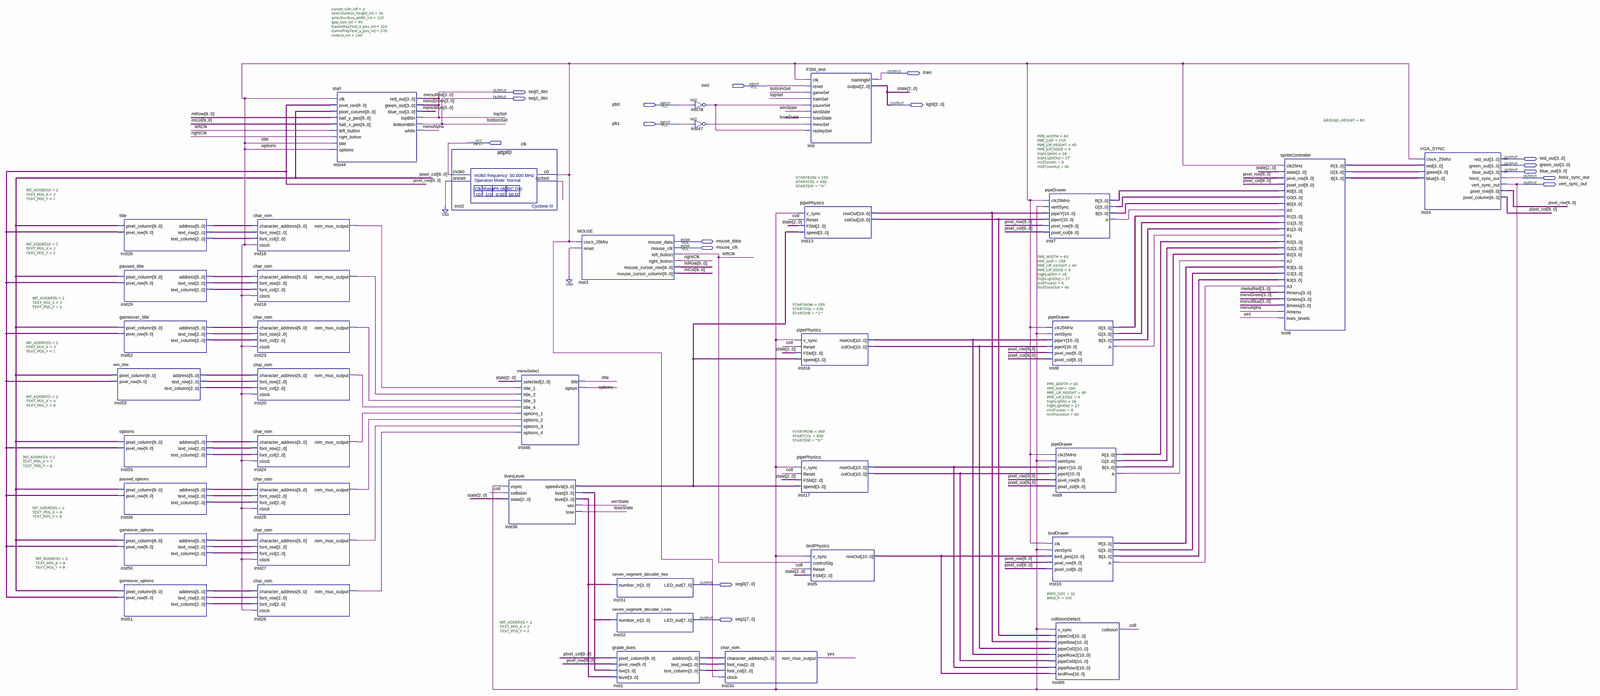
[diagram p0: schematic sheet, whole]
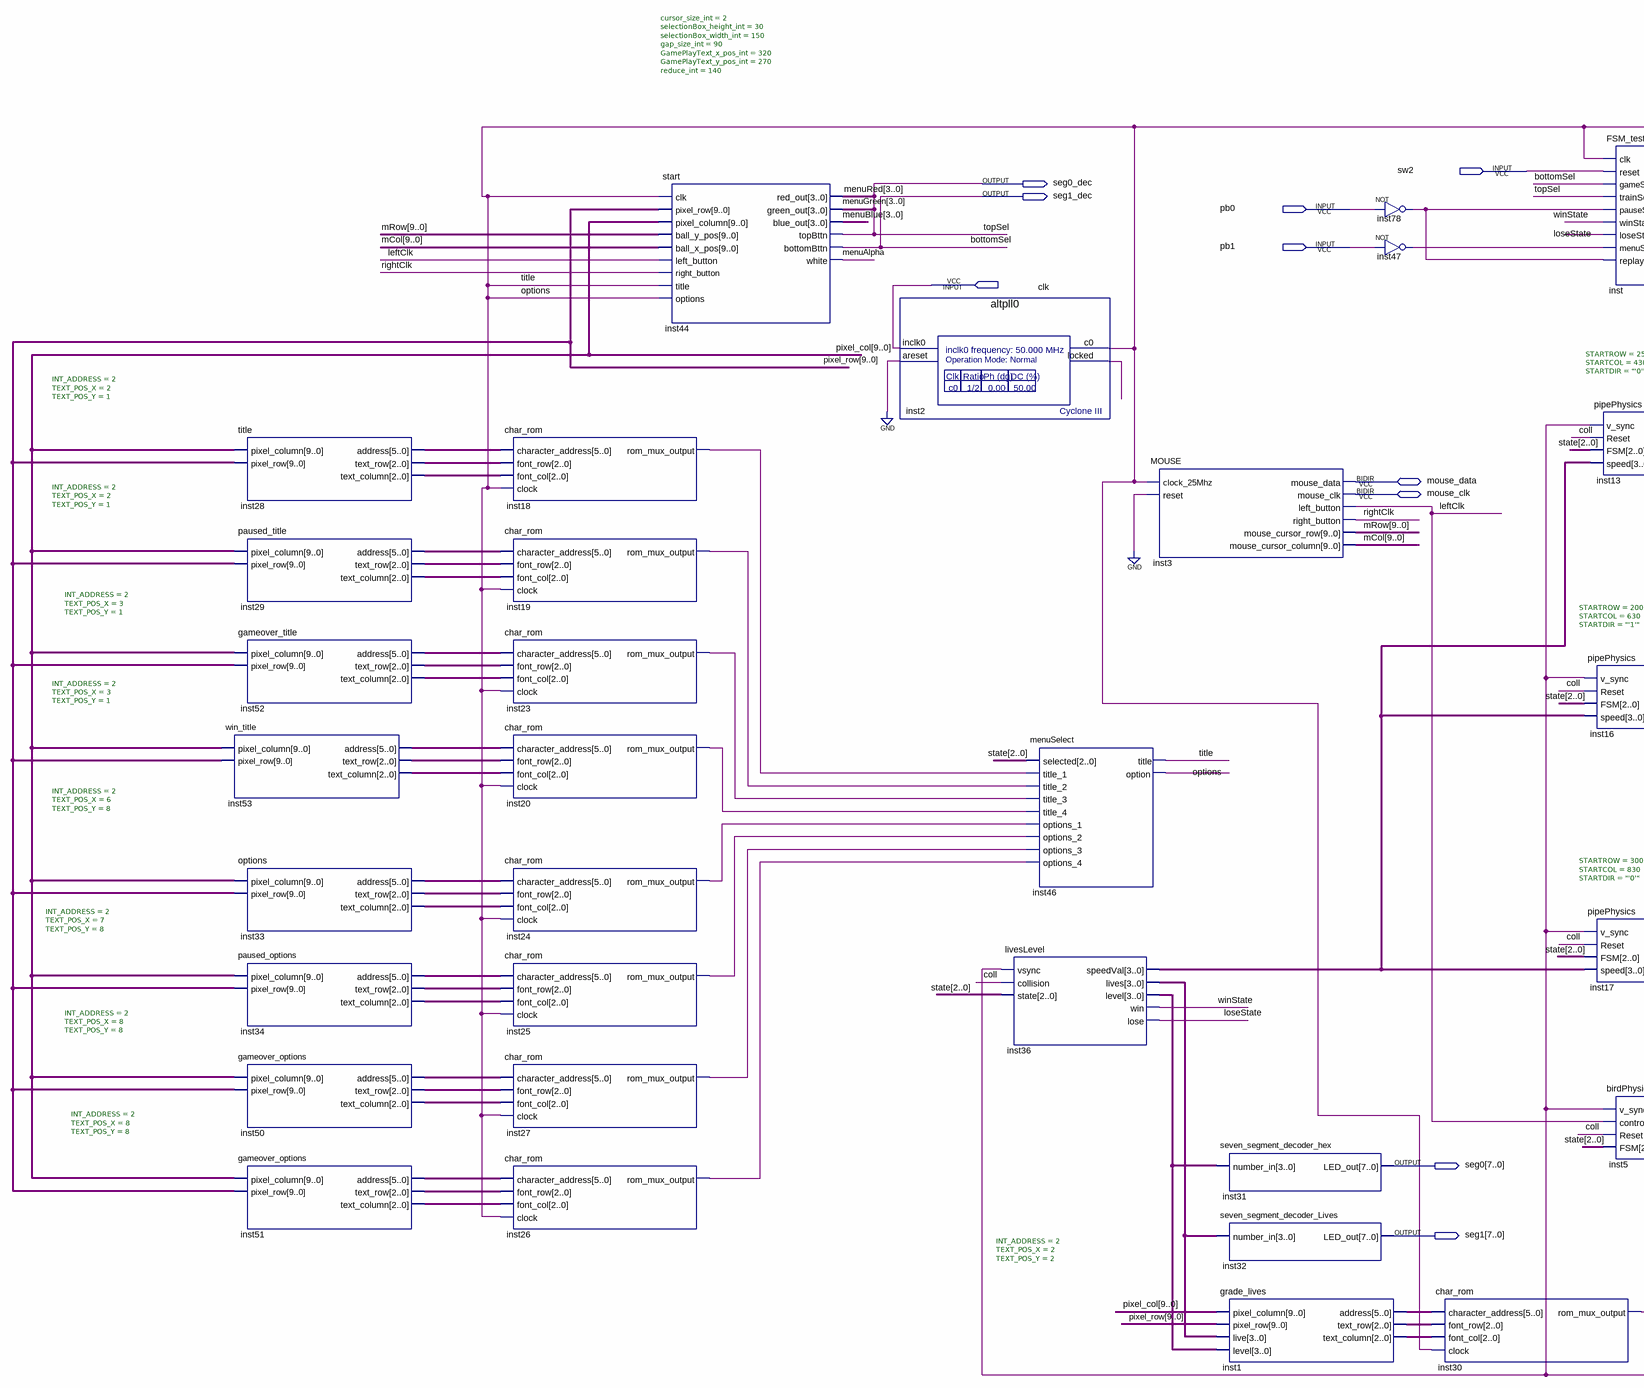
[diagram p1: schematic sheet, left part]
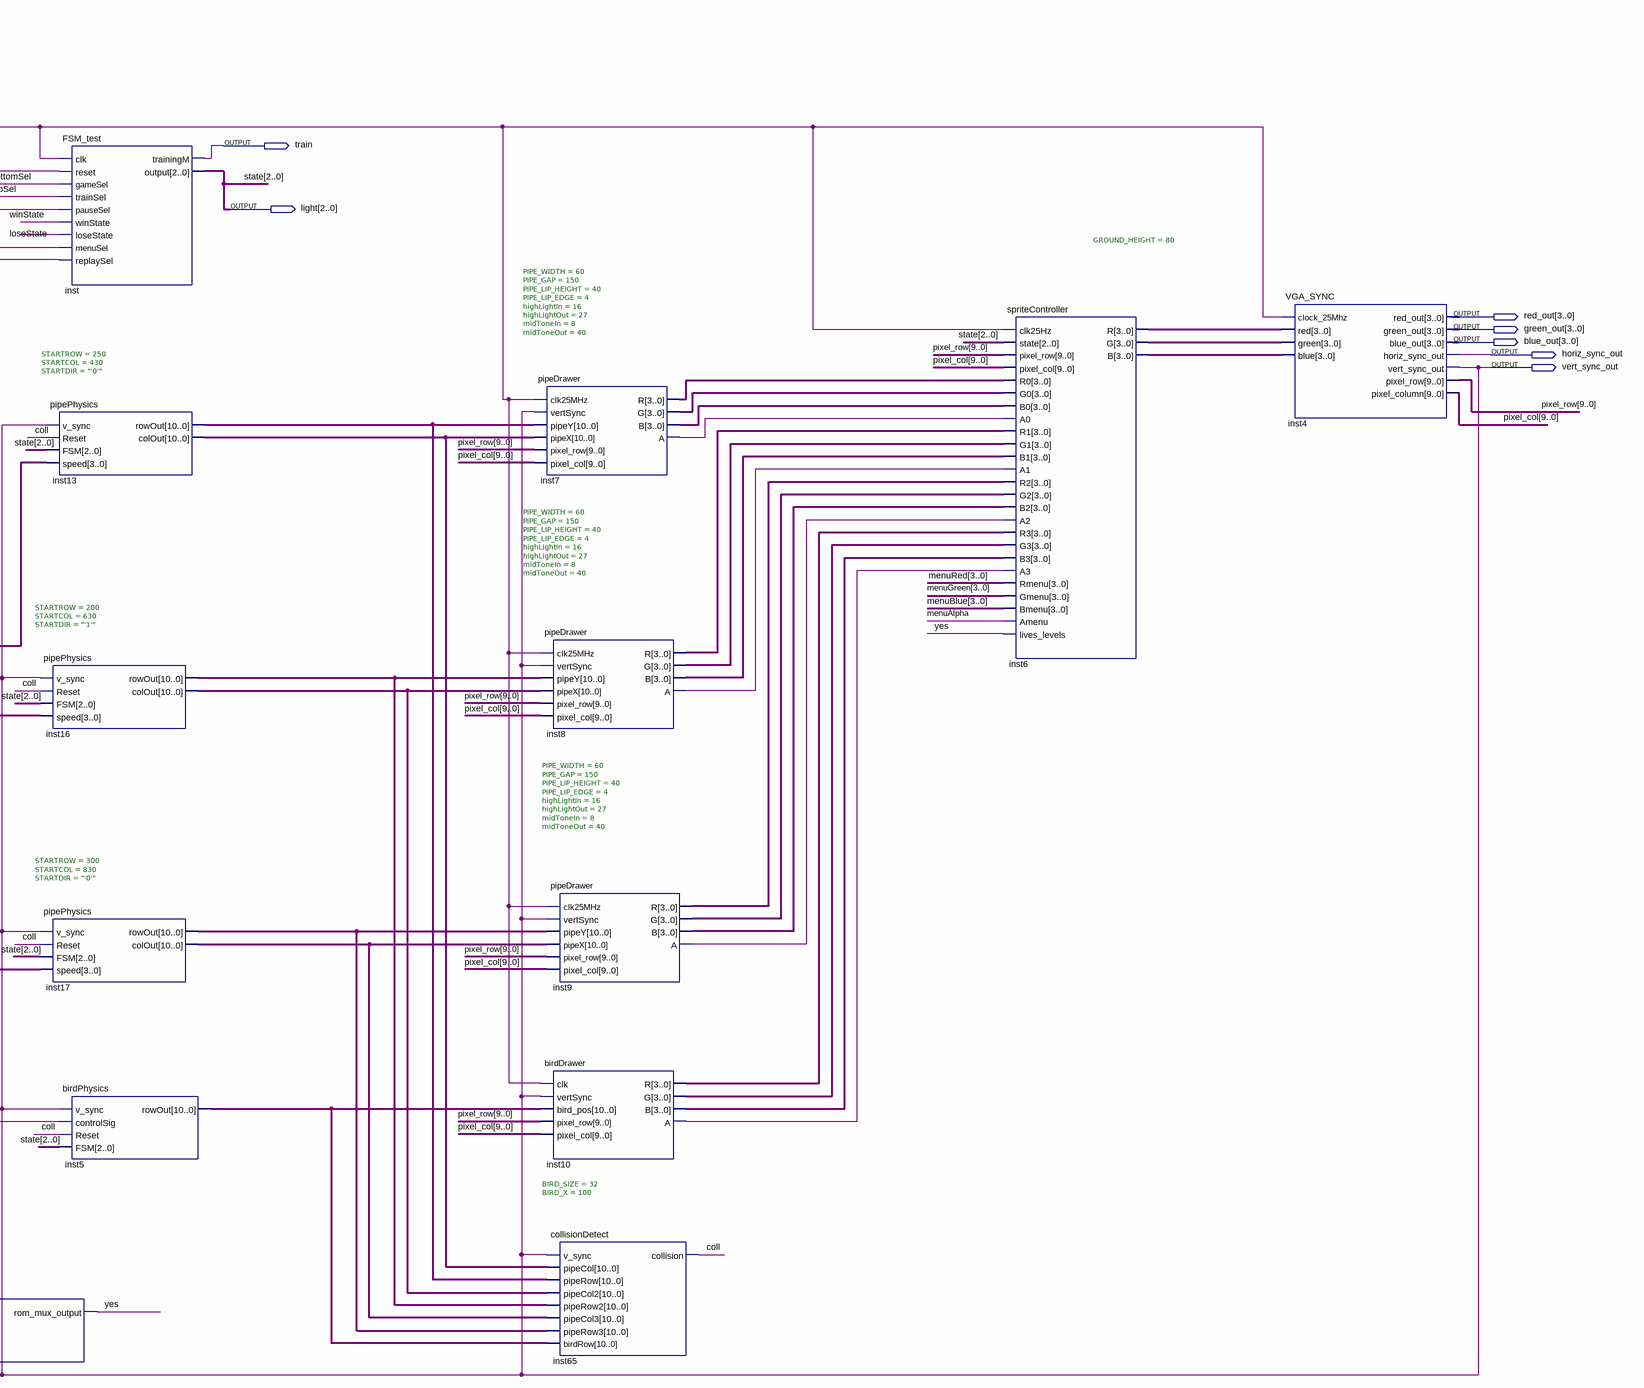
[diagram p2: schematic sheet, right part]
// Quartus schematic Flappy-Grades.bdf as structural Verilog: 39 symbols, 17 pins
module \Flappy-Grades  (
  input  sw2,
  input  pb0,
  input  pb1,
  input  clk,
  inout  mouse_data,
  inout  mouse_clk,
  output train,
  output seg0_dec,
  output seg1_dec,
  output [2:0] light,
  output [3:0] red_out,
  output [3:0] green_out,
  output [3:0] blue_out,
  output horiz_sync_out,
  output vert_sync_out,
  output [7:0] seg0,
  output [7:0] seg1
);

  wire coll, inst2_locked, inst7_a, inst8_a, inst9_a, inst10_a, inst18_rom_mux_output, inst19_rom_mux_output,
       inst20_rom_mux_output, inst23_rom_mux_output, inst24_rom_mux_output, inst25_rom_mux_output,
       inst26_rom_mux_output, inst27_rom_mux_output, inst47_out, inst78_out, leftClk, loseState, menuAlpha,
       options, rightClk, topSel, winState, yes;
  wire [2:0] inst1_text_column, inst1_text_row, inst28_text_column, inst28_text_row, inst29_text_column,
       inst29_text_row, inst33_text_column, inst33_text_row, inst34_text_column, inst34_text_row,
       inst50_text_column, inst50_text_row, inst51_text_column, inst51_text_row, inst52_text_column,
       inst52_text_row, inst53_text_column, inst53_text_row;
  wire [3:0] inst6_b, inst6_g, inst6_r, inst7_b, inst7_g, inst7_r, inst8_b, inst8_g, inst8_r, inst9_b,
       inst9_g, inst9_r, inst10_b, inst10_g, inst10_r, inst36_level, inst36_lives, inst36_speedval, menuBlue,
       menuGreen, menuRed;
  wire [5:0] inst1_address, inst28_address, inst29_address, inst33_address, inst34_address, inst50_address,
       inst51_address, inst52_address, inst53_address;
  wire [9:0] mCol, mRow, pixel_col, pixel_row;
  wire [10:0] inst5_rowout, inst13_colout, inst13_rowout, inst16_colout, inst16_rowout, inst17_colout,
       inst17_rowout;

  title #(.INT_ADDRESS(2), .TEXT_POS_X(2), .TEXT_POS_Y(1)) inst28 (
    .pixel_column(pixel_col), .pixel_row(pixel_row), .address(inst28_address), .text_row(inst28_text_row),
    .text_column(inst28_text_column));
  paused_title #(.INT_ADDRESS(2), .TEXT_POS_X(2), .TEXT_POS_Y(1)) inst29 (
    .pixel_column(pixel_col), .pixel_row(pixel_row), .address(inst29_address), .text_row(inst29_text_row),
    .text_column(inst29_text_column));
  gameover_title #(.INT_ADDRESS(2), .TEXT_POS_X(3), .TEXT_POS_Y(1)) inst52 (
    .pixel_column(pixel_col), .pixel_row(pixel_row), .address(inst52_address), .text_row(inst52_text_row),
    .text_column(inst52_text_column));
  win_title #(.INT_ADDRESS(2), .TEXT_POS_X(3), .TEXT_POS_Y(1)) inst53 (
    .pixel_column(pixel_col), .pixel_row(pixel_row), .address(inst53_address), .text_row(inst53_text_row),
    .text_column(inst53_text_column));
  options #(.INT_ADDRESS(2), .TEXT_POS_X(6), .TEXT_POS_Y(8)) inst33 (
    .pixel_column(pixel_col), .pixel_row(pixel_row), .address(inst33_address), .text_row(inst33_text_row),
    .text_column(inst33_text_column));
  paused_options #(.INT_ADDRESS(2), .TEXT_POS_X(7), .TEXT_POS_Y(8)) inst34 (
    .pixel_column(pixel_col), .pixel_row(pixel_row), .address(inst34_address), .text_row(inst34_text_row),
    .text_column(inst34_text_column));
  gameover_options #(.INT_ADDRESS(2), .TEXT_POS_X(8), .TEXT_POS_Y(8)) inst50 (
    .pixel_column(pixel_col), .pixel_row(pixel_row), .address(inst50_address), .text_row(inst50_text_row),
    .text_column(inst50_text_column));
  gameover_options #(.INT_ADDRESS(2), .TEXT_POS_X(8), .TEXT_POS_Y(8)) inst51 (
    .pixel_column(pixel_col), .pixel_row(pixel_row), .address(inst51_address), .text_row(inst51_text_row),
    .text_column(inst51_text_column));
  char_rom inst18 (
    .character_address(inst28_address), .font_row(inst28_text_row), .font_col(inst28_text_column),
    .clock(options), .rom_mux_output(inst18_rom_mux_output));
  char_rom inst19 (
    .character_address(inst29_address), .font_row(inst29_text_row), .font_col(inst29_text_column),
    .clock(options), .rom_mux_output(inst19_rom_mux_output));
  char_rom inst23 (
    .character_address(inst52_address), .font_row(inst52_text_row), .font_col(inst52_text_column),
    .clock(options), .rom_mux_output(inst23_rom_mux_output));
  char_rom inst20 (
    .character_address(inst53_address), .font_row(inst53_text_row), .font_col(inst53_text_column),
    .clock(options), .rom_mux_output(inst20_rom_mux_output));
  char_rom inst24 (
    .character_address(inst33_address), .font_row(inst33_text_row), .font_col(inst33_text_column),
    .clock(options), .rom_mux_output(inst24_rom_mux_output));
  char_rom inst25 (
    .character_address(inst34_address), .font_row(inst34_text_row), .font_col(inst34_text_column),
    .clock(options), .rom_mux_output(inst25_rom_mux_output));
  char_rom inst27 (
    .character_address(inst50_address), .font_row(inst50_text_row), .font_col(inst50_text_column),
    .clock(options), .rom_mux_output(inst27_rom_mux_output));
  char_rom inst26 (
    .character_address(inst51_address), .font_row(inst51_text_row), .font_col(inst51_text_column),
    .clock(options), .rom_mux_output(inst26_rom_mux_output));
  start #(.cursor_size_int(2), .selectionBox_height_int(30), .selectionBox_width_int(150), .gap_size_int(90), .GamePlayText_x_pos_int(320), .GamePlayText_y_pos_int(270), .reduce_int(140)) inst44 (
    .clk(options), .pixel_row(pixel_row), .pixel_column(pixel_col), .ball_y_pos(mRow), .ball_x_pos(mCol),
    .left_button(leftClk), .right_button(rightClk), .title(options), .options(options), .red_out(menuRed),
    .green_out(menuGreen), .blue_out(menuBlue), .topBttn(topSel), .bottomBttn(seg1_dec), .white(menuAlpha));
  altpll0 inst2 (.inclk0(clk), .areset(1'b0), .c0(options), .locked(inst2_locked));
  menuSelect inst46 (
    .selected(light), .title_1(inst18_rom_mux_output), .title_2(inst19_rom_mux_output),
    .title_3(inst23_rom_mux_output), .title_4(inst20_rom_mux_output), .options_1(inst24_rom_mux_output),
    .options_2(inst25_rom_mux_output), .options_3(inst27_rom_mux_output), .options_4(inst26_rom_mux_output),
    .title(options), .option(options));
  livesLevel inst36 (
    .vsync(vert_sync_out), .collision(coll), .state(light), .speedVal(inst36_speedval), .lives(inst36_lives),
    .level(inst36_level), .win(winState), .lose(loseState));
  MOUSE inst3 (
    .clock_25Mhz(options), .reset(1'b0), .left_button(leftClk), .right_button(rightClk),
    .mouse_cursor_row(mRow), .mouse_cursor_column(mCol), .mouse_data(mouse_data), .mouse_clk(mouse_clk));
  seven_segment_decoder_hex inst31 (.number_in(inst36_level), .LED_out(seg0));
  seven_segment_decoder_Lives inst32 (.number_in(inst36_lives), .LED_out(seg1));
  grade_lives #(.INT_ADDRESS(2), .TEXT_POS_X(2), .TEXT_POS_Y(2)) inst1 (
    .pixel_column(pixel_col), .pixel_row(pixel_row), .live(inst36_lives), .level(inst36_level),
    .address(inst1_address), .text_row(inst1_text_row), .text_column(inst1_text_column));
  not inst78 (inst78_out, pb0);
  not inst47 (inst47_out, pb1);
  char_rom inst30 (
    .character_address(inst1_address), .font_row(inst1_text_row), .font_col(inst1_text_column),
    .clock(options), .rom_mux_output(yes));
  pipePhysics #(.STARTROW(200), .STARTCOL(630), .STARTDIR("'1'")) inst16 (
    .v_sync(vert_sync_out), .Reset(coll), .FSM(light), .speed(inst36_speedval), .rowOut(inst16_rowout),
    .colOut(inst16_colout));
  pipePhysics #(.STARTROW(300), .STARTCOL(830), .STARTDIR("'0'")) inst17 (
    .v_sync(vert_sync_out), .Reset(coll), .FSM(light), .speed(inst36_speedval), .rowOut(inst17_rowout),
    .colOut(inst17_colout));
  FSM_test inst (
    .clk(options), .reset(sw2), .gameSel(seg1_dec), .trainSel(topSel), .pauseSel(inst78_out),
    .winState(winState), .loseState(loseState), .menuSel(inst47_out), .replaySel(inst78_out),
    .trainingM(train), .\output (light));
  pipePhysics #(.STARTROW(250), .STARTCOL(430), .STARTDIR("'0'")) inst13 (
    .v_sync(vert_sync_out), .Reset(coll), .FSM(light), .speed(inst36_speedval), .rowOut(inst13_rowout),
    .colOut(inst13_colout));
  birdPhysics inst5 (.v_sync(vert_sync_out), .controlSig(leftClk), .Reset(coll), .FSM(light), .rowOut(inst5_rowout));
  pipeDrawer #(.PIPE_WIDTH(60), .PIPE_GAP(150), .PIPE_LIP_HEIGHT(40), .PIPE_LIP_EDGE(4), .highLightIn(16), .highLightOut(27), .midToneIn(8), .midToneOut(40)) inst7 (
    .clk25MHz(options), .vertSync(vert_sync_out), .pipeY(inst13_rowout), .pipeX(inst13_colout),
    .pixel_row(pixel_row), .pixel_col(pixel_col), .R(inst7_r), .G(inst7_g), .B(inst7_b), .A(inst7_a));
  pipeDrawer #(.PIPE_WIDTH(60), .PIPE_GAP(150), .PIPE_LIP_HEIGHT(40), .PIPE_LIP_EDGE(4), .highLightIn(16), .highLightOut(27), .midToneIn(8), .midToneOut(40)) inst8 (
    .clk25MHz(options), .vertSync(vert_sync_out), .pipeY(inst16_rowout), .pipeX(inst16_colout),
    .pixel_row(pixel_row), .pixel_col(pixel_col), .R(inst8_r), .G(inst8_g), .B(inst8_b), .A(inst8_a));
  pipeDrawer #(.PIPE_WIDTH(60), .PIPE_GAP(150), .PIPE_LIP_HEIGHT(40), .PIPE_LIP_EDGE(4), .highLightIn(16), .highLightOut(27), .midToneIn(8), .midToneOut(40)) inst9 (
    .clk25MHz(options), .vertSync(vert_sync_out), .pipeY(inst17_rowout), .pipeX(inst17_colout),
    .pixel_row(pixel_row), .pixel_col(pixel_col), .R(inst9_r), .G(inst9_g), .B(inst9_b), .A(inst9_a));
  birdDrawer #(.BIRD_SIZE(32), .BIRD_X(100)) inst10 (
    .clk(options), .vertSync(vert_sync_out), .bird_pos(inst5_rowout), .pixel_row(pixel_row),
    .pixel_col(pixel_col), .R(inst10_r), .G(inst10_g), .B(inst10_b), .A(inst10_a));
  collisionDetect inst65 (
    .v_sync(vert_sync_out), .pipeCol(inst13_colout), .pipeRow(inst13_rowout), .pipeCol2(inst16_colout),
    .pipeRow2(inst16_rowout), .pipeCol3(inst17_colout), .pipeRow3(inst17_rowout), .birdRow(inst5_rowout),
    .collision(coll));
  spriteController #(.GROUND_HEIGHT(80)) inst6 (
    .clk25Hz(options), .state(light), .pixel_row(pixel_row), .pixel_col(pixel_col), .R0(inst7_r),
    .G0(inst7_g), .B0(inst7_b), .A0(inst7_a), .R1(inst8_r), .G1(inst8_g), .B1(inst8_b), .A1(inst8_a),
    .R2(inst9_r), .G2(inst9_g), .B2(inst9_b), .A2(inst9_a), .R3(inst10_r), .G3(inst10_g), .B3(inst10_b),
    .A3(inst10_a), .Rmenu(menuRed), .Gmenu(menuGreen), .Bmenu(menuBlue), .Amenu(menuAlpha),
    .lives_levels(yes), .R(inst6_r), .G(inst6_g), .B(inst6_b));
  VGA_SYNC inst4 (
    .clock_25Mhz(options), .red(inst6_r), .green(inst6_g), .blue(inst6_b), .red_out(red_out),
    .green_out(green_out), .blue_out(blue_out), .horiz_sync_out(horiz_sync_out),
    .vert_sync_out(vert_sync_out), .pixel_row(pixel_row), .pixel_column(pixel_col));

  // Other names for the same wires on the sheet: bottomSel = seg1_dec; state[2:0] = light; title = options
endmodule
